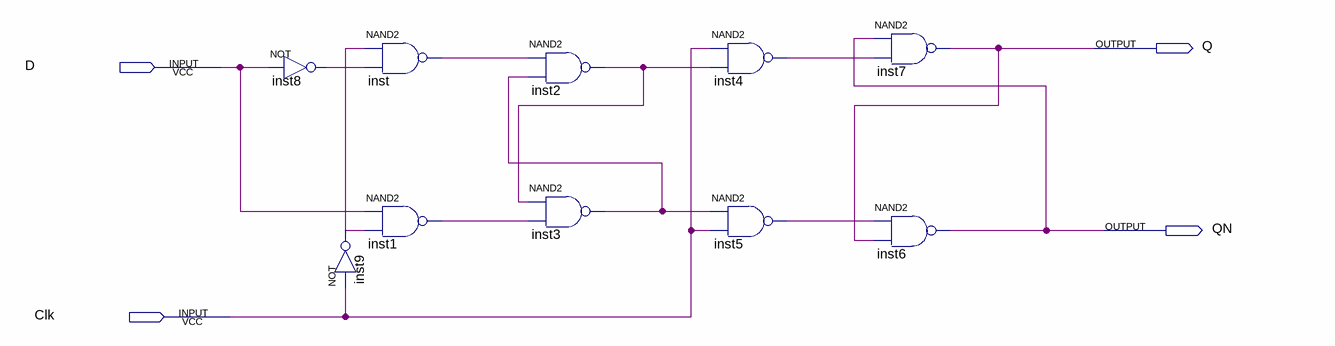
[diagram p0: schematic sheet]
// Quartus schematic PEDflipFlop.bdf as structural Verilog: 10 symbols, 4 pins
module PEDflipFlop (
  input  D,
  input  Clk,
  output Q,
  output QN
);

  wire inst1_out, inst2_out, inst3_out, inst4_out, inst5_out, inst8_out, inst9_out, inst_out;

  not inst8 (inst8_out, D);
  not inst9 (inst9_out, Clk);
  nand inst (inst_out, inst9_out, inst8_out);
  nand inst1 (inst1_out, D, inst9_out);
  nand inst2 (inst2_out, inst_out, inst3_out);
  nand inst3 (inst3_out, inst2_out, inst1_out);
  nand inst4 (inst4_out, Clk, inst2_out);
  nand inst5 (inst5_out, inst3_out, Clk);
  nand inst7 (Q, QN, inst4_out);
  nand inst6 (QN, inst5_out, Q);
endmodule
